# Altium schematic sheet ATSAM4E16EA_AU Main Controller.SchDoc
size C
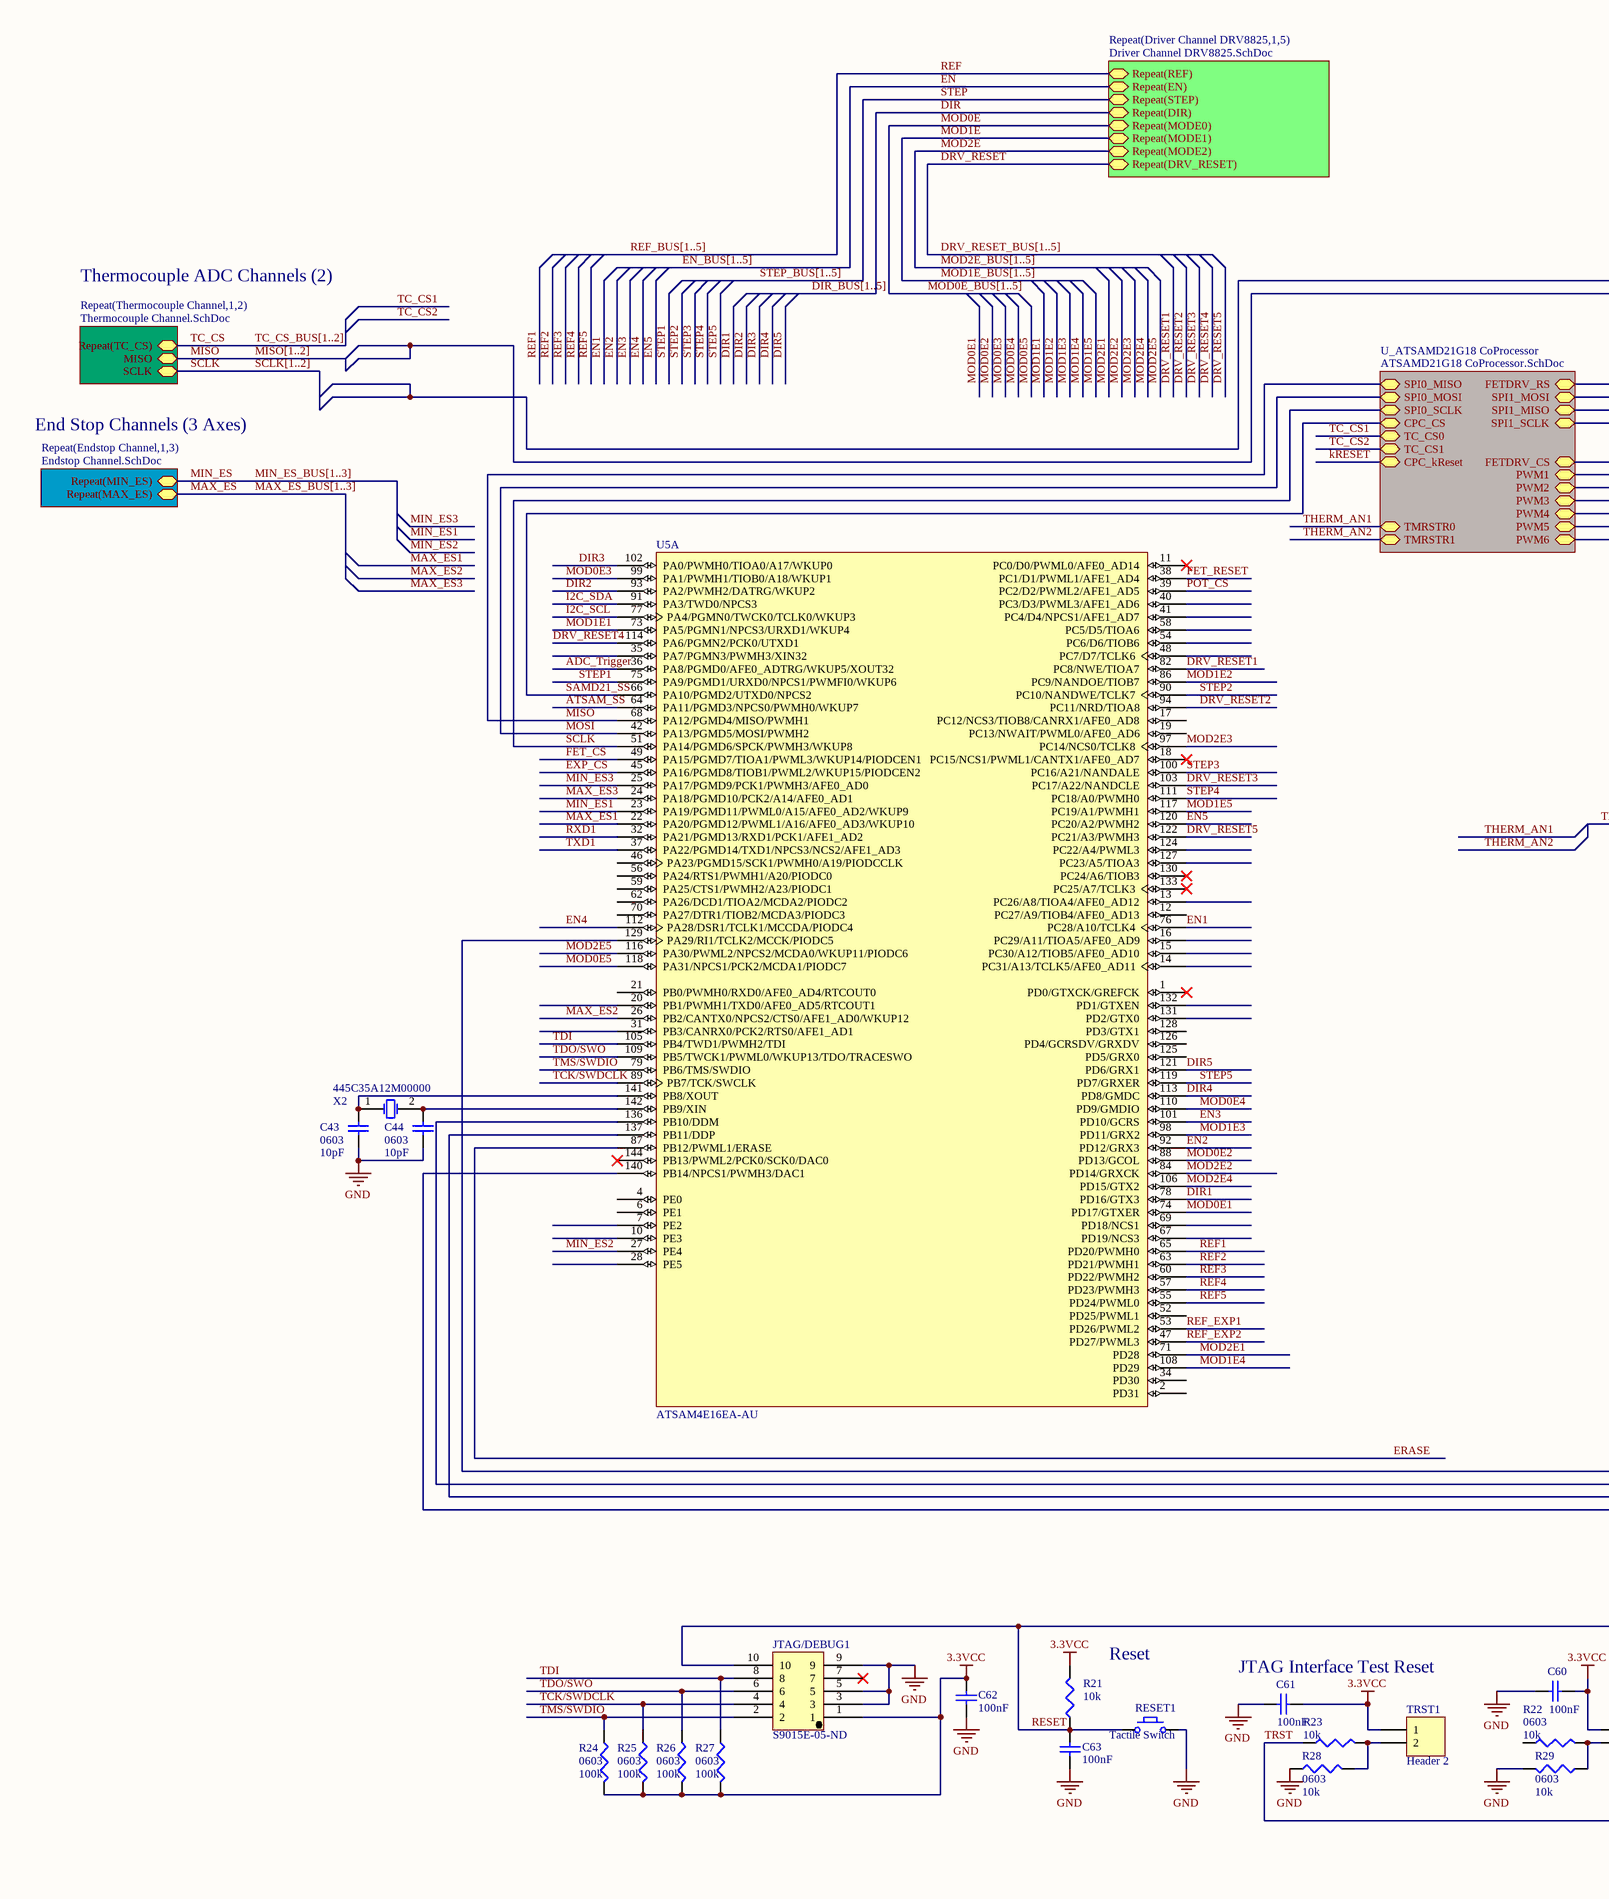
[diagram p0: ATSAM4E16EA_AU Main Controller.SchDoc, left]
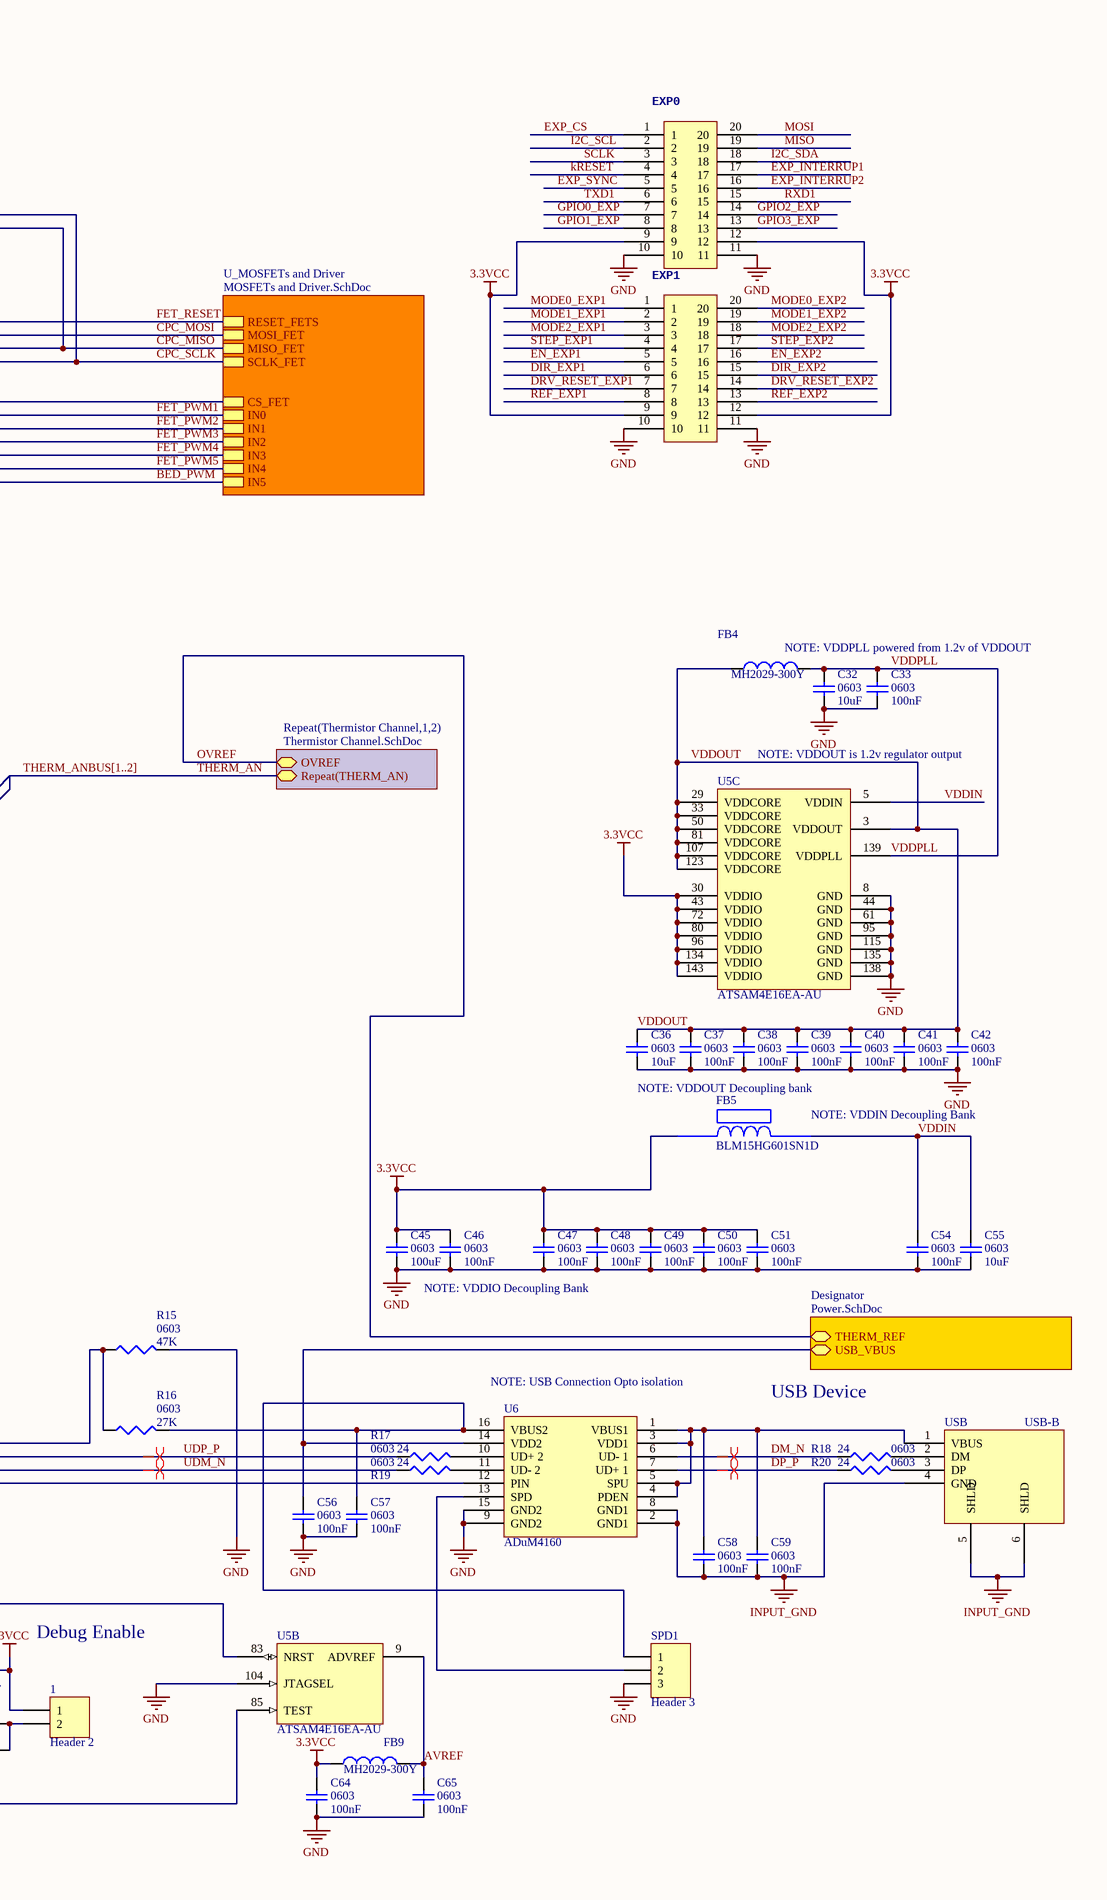
[diagram p1: ATSAM4E16EA_AU Main Controller.SchDoc, right]

## Parts
1  Header 2  [HDR1X2]
C32  0603  value 10uF  [1608[0603]]
C33  0603  value 100nF  [1608[0603]]
C36  0603  value 10uF  [1608[0603]]
C37  0603  value 100nF  [1608[0603]]
C38  0603  value 100nF  [1608[0603]]
C39  0603  value 100nF  [1608[0603]]
C40  0603  value 100nF  [1608[0603]]
C41  0603  value 100nF  [1608[0603]]
C42  0603  value 100nF  [1608[0603]]
C43  0603  value 10pF  [1608[0603]]
C44  0603  value 10pF  [1608[0603]]
C45  0603  value 100uF  [1608[0603]]
C46  0603  value 100nF  [1608[0603]]
C47  0603  value 100nF  [1608[0603]]
C48  0603  value 100nF  [1608[0603]]
C49  0603  value 100nF  [1608[0603]]
C50  0603  value 100nF  [1608[0603]]
C51  0603  value 100nF  [1608[0603]]
C54  0603  value 100nF  [1608[0603]]
C55  0603  value 10uF  [1608[0603]]
C56  0603  value 100nF  [1608[0603]]
C57  0603  value 100nF  [1608[0603]]
C58  0603  value 100nF  [1608[0603]]
C59  0603  value 100nF  [1608[0603]]
C60  value 100nF  [1608[0603]]  (hidden comment: Cap Semi)
C61  value 100nF  [1608[0603]]  (hidden comment: Cap Semi)
C62  value 100nF  [1608[0603]]  (hidden comment: Cap Semi)
C63  value 100nF  [1608[0603]]  (hidden comment: Cap Semi)
C64  0603  value 100nF  [1608[0603]]
C65  0603  value 100nF  [1608[0603]]
EXP0  10X2-0.1X0.05  [10X2-0.05X0.1]  (value not drawn)
EXP1  10X2-0.1X0.05  [10X2-0.05X0.1]  (value not drawn)
FB4  MH2029-300Y  [SM 0805 - gap trimmed]
FB5  BLM15HG601SN1D  [BLM18PG121SN1D]
FB9  MH2029-300Y  [SM 0805 - gap trimmed]
JTAG/DEBUG1  S9015E-05-ND  [S9015E-05-ND]
R15  0603  value 47K  [J1-0603]
R16  0603  value 27K  [J1-0603]
R17  0603  value 24  [J1-0603]
R18  0603  value 24  [J1-0603]
R19  0603  value 24  [J1-0603]
R20  0603  value 24  [J1-0603]
R21  value 10k  [J1-0603]  (hidden comment: Res3)
R22  0603  value 10k  [J1-0603]
R23  value 10k  [J1-0603]  (hidden comment: Res3)
R24  0603  value 100k  [J1-0603]
R25  0603  value 100k  [J1-0603]
R26  0603  value 100k  [J1-0603]
R27  0603  value 100k  [J1-0603]
R28  0603  value 10k  [J1-0603]
R29  0603  value 10k  [J1-0603]
RESET1  Tactile Switch  [TL3301]
SPD1  Header 3  [HDR1X3]
TRST1  Header 2  [HDR1X2]
U5  ATSAM4E16EA-AU  [LQFP144_N]  (parts A,B,C of 3)
U6  ADuM4160  [ADuM4160]
USB  USB-B  [PN61729]
X2  445C35A12M00000  [445C35A12M00000]

## Sub-sheets
Designator = Power.SchDoc: USB_VBUS (bidir), THERM_REF
Repeat(Driver Channel DRV8825,1,5) = Driver Channel DRV8825.SchDoc: Repeat(REF), Repeat(EN), Repeat(STEP), Repeat(DIR), Repeat(MODE0), Repeat(MODE1), Repeat(MODE2), Repeat(DRV_RESET)
Repeat(Endstop Channel,1,3) = Endstop Channel.SchDoc: Repeat(MAX_ES), Repeat(MIN_ES)
Repeat(Thermistor Channel,1,2) = Thermistor Channel.SchDoc: OVREF, Repeat(THERM_AN)
Repeat(Thermocouple Channel,1,2) = Thermocouple Channel.SchDoc: SCLK, MISO, Repeat(TC_CS)
U_ATSAMD21G18 CoProcessor = ATSAMD21G18 CoProcessor.SchDoc: SPI0_MOSI, SPI0_MISO, SPI0_SCLK, CPC_CS, SPI1_MOSI, SPI1_MISO, SPI1_SCLK, TC_CS0, TC_CS1, FETDRV_CS, FETDRV_RS, PWM1, PWM2, PWM3, PWM4, PWM5, PWM6, CPC_kReset, TMRSTR0, TMRSTR1
U_MOSFETs and Driver = MOSFETs and Driver.SchDoc: RESET_FETS, MISO_FET, SCLK_FET, MOSI_FET, CS_FET, IN0, IN1, IN2, IN3, IN4, IN5

## Nets
3.3VCC: 1.1 C45.2 C46.2 C47.2 C48.2 C49.2 C50.2 C51.2 C60.2 C61.2 C62.2 C64.2 EXP0.9 EXP0.12 EXP1.9 EXP1.12 FB5.1 FB9.1 JTAG/DEBUG1.1 R21.2 R24.2 R25.2 R26.2 R27.2 TRST1.1 U5.30(VDDIO) U5.43(VDDIO) U5.72(VDDIO) U5.80(VDDIO) U5.96(VDDIO) U5.134(VDDIO) U5.143(VDDIO)
GND: C32.1 C33.1 C36.1 C37.1 C38.1 C39.1 C40.1 C41.1 C42.1 C43.1 C44.1 C45.1 C46.1 C47.1 C48.1 C49.1 C50.1 C51.1 C54.1 C55.1 C56.1 C57.1 C60.1 C61.1 C62.1 C63.1 C64.1 C65.1 EXP0.10 EXP0.11 EXP1.10 EXP1.11 JTAG/DEBUG1.3 JTAG/DEBUG1.5 JTAG/DEBUG1.9 R15.2 R28.1 R29.2 RESET1.2 SPD1.3 U5.8(GND) U5.44(GND) U5.61(GND) U5.95(GND) U5.104(JTAGSEL) U5.115(GND) U5.135(GND) U5.138(GND) U6.9(GND2) U6.15(GND2)
INPUT_GND: C58.1 C59.1 U6.2(GND1) U6.8(GND1) USB.4(GND) USB.5(SHLD) USB.6(SHLD)
ADC_Trigger: U5.36(PA8/PGMD0/AFE0_ADTRG/WKUP5/XOUT32)
ATSAM_SS: U5.64(PA11/PGMD3/NPCS0/PWMH0/WKUP7)
AVREF: C65.2 FB9.2 U5.9(ADVREF)
BED_PWM: sheet U_MOSFETs and Driver/IN5, sheet U_ATSAMD21G18 CoProcessor/PWM6
CPC_MISO: sheet U_MOSFETs and Driver/MISO_FET, sheet U_ATSAMD21G18 CoProcessor/SPI1_MISO
CPC_MOSI: sheet U_MOSFETs and Driver/MOSI_FET, sheet U_ATSAMD21G18 CoProcessor/SPI1_MOSI
CPC_SCLK: sheet U_MOSFETs and Driver/SCLK_FET, sheet U_ATSAMD21G18 CoProcessor/SPI1_SCLK
DIR: sheet Repeat(Driver Channel DRV8825,1,5)/Repeat(DIR)
DIR1: U5.78(PD16/GTX3)
DIR2: U5.93(PA2/PWMH2/DATRG/WKUP2)
DIR3: U5.102(PA0/PWMH0/TIOA0/A17/WKUP0)
DIR4: U5.113(PD8/GMDC)
DIR5: U5.121(PD6/GRX1)
DIR_EXP1: EXP1.6
DIR_EXP2: EXP1.15
DM_N: R18.1 U6.6(UD-_1)
DP_P: R20.1 U6.7(UD+_1)
DRV_RESET: sheet Repeat(Driver Channel DRV8825,1,5)/Repeat(DRV_RESET)
DRV_RESET1: U5.82(PC8/NWE/TIOA7)
DRV_RESET2: U5.94(PC11/NRD/TIOA8)
DRV_RESET3: U5.103(PC17/A22/NANDCLE)
DRV_RESET4: U5.114(PA6/PGMN2/PCK0/UTXD1)
DRV_RESET5: U5.122(PC21/A3/PWMH3)
DRV_RESET_EXP1: EXP1.7
DRV_RESET_EXP2: EXP1.14
EN: sheet Repeat(Driver Channel DRV8825,1,5)/Repeat(EN)
EN1: U5.76(PC28/A10/TCLK4)
EN2: U5.92(PD12/GRX3)
EN3: U5.101(PD10/GCRS)
EN4: U5.112(PA28/DSR1/TCLK1/MCCDA/PIODC4)
EN5: U5.120(PC20/A2/PWMH2)
EN_EXP1: EXP1.5
EN_EXP2: EXP1.16
ERASE: U5.87(PB12/PWML1/ERASE)
EXP_CS: EXP0.1 U5.45(PA16/PGMD8/TIOB1/PWML2/WKUP15/PIODCEN2)
EXP_INTERRUP1: EXP0.17
EXP_INTERRUP2: EXP0.16
EXP_SYNC: EXP0.5
FET_CS: U5.49(PA15/PGMD7/TIOA1/PWML3/WKUP14/PIODCEN1)
FET_PWM1: sheet U_MOSFETs and Driver/IN0, sheet U_ATSAMD21G18 CoProcessor/PWM1
FET_PWM2: sheet U_MOSFETs and Driver/IN1, sheet U_ATSAMD21G18 CoProcessor/PWM2
FET_PWM3: sheet U_MOSFETs and Driver/IN2, sheet U_ATSAMD21G18 CoProcessor/PWM3
FET_PWM4: sheet U_MOSFETs and Driver/IN3, sheet U_ATSAMD21G18 CoProcessor/PWM4
FET_PWM5: sheet U_MOSFETs and Driver/IN4, sheet U_ATSAMD21G18 CoProcessor/PWM5
FET_RESET: U5.38(PC1/D1/PWML1/AFE1_AD4) ; sheet U_MOSFETs and Driver/RESET_FETS, sheet U_ATSAMD21G18 CoProcessor/FETDRV_RS
GPIO0_EXP: EXP0.7
GPIO1_EXP: EXP0.8
GPIO2_EXP: EXP0.14
GPIO3_EXP: EXP0.13
I2C_SCL: EXP0.2 U5.77(PA4/PGMN0/TWCK0/TCLK0/WKUP3)
I2C_SDA: EXP0.18 U5.91(PA3/TWD0/NPCS3)
kRESET: EXP0.4 ; sheet U_ATSAMD21G18 CoProcessor/CPC_kReset
MAX_ES: sheet Repeat(Endstop Channel,1,3)/Repeat(MAX_ES)
MAX_ES1: U5.22(PA20/PGMD12/PWML1/A16/AFE0_AD3/WKUP10)
MAX_ES2: U5.26(PB2/CANTX0/NPCS2/CTS0/AFE1_AD0/WKUP12)
MAX_ES3: U5.24(PA18/PGMD10/PCK2/A14/AFE0_AD1)
MIN_ES: sheet Repeat(Endstop Channel,1,3)/Repeat(MIN_ES)
MIN_ES1: U5.23(PA19/PGMD11/PWML0/A15/AFE0_AD2/WKUP9)
MIN_ES2: U5.27(PE4)
MIN_ES3: U5.25(PA17/PGMD9/PCK1/PWMH3/AFE0_AD0)
MISO: EXP0.19 U5.68(PA12/PGMD4/MISO/PWMH1) ; sheet Repeat(Thermocouple Channel,1,2)/MISO, sheet U_ATSAMD21G18 CoProcessor/SPI0_MISO
MOD0E: sheet Repeat(Driver Channel DRV8825,1,5)/Repeat(MODE0)
MOD0E1: U5.74(PD17/GTXER)
MOD0E2: U5.88(PD13/GCOL)
MOD0E3: U5.99(PA1/PWMH1/TIOB0/A18/WKUP1)
MOD0E4: U5.110(PD9/GMDIO)
MOD0E5: U5.118(PA31/NPCS1/PCK2/MCDA1/PIODC7)
MOD1E: sheet Repeat(Driver Channel DRV8825,1,5)/Repeat(MODE1)
MOD1E1: U5.73(PA5/PGMN1/NPCS3/URXD1/WKUP4)
MOD1E2: U5.86(PC9/NANDOE/TIOB7)
MOD1E3: U5.98(PD11/GRX2)
MOD1E4: U5.108(PD29)
MOD1E5: U5.117(PC19/A1/PWMH1)
MOD2E: sheet Repeat(Driver Channel DRV8825,1,5)/Repeat(MODE2)
MOD2E1: U5.71(PD28)
MOD2E2: U5.84(PD14/GRXCK)
MOD2E3: U5.97(PC14/NCS0/TCLK8)
MOD2E4: U5.106(PD15/GTX2)
MOD2E5: U5.116(PA30/PWML2/NPCS2/MCDA0/WKUP11/PIODC6)
MODE0_EXP1: EXP1.1
MODE0_EXP2: EXP1.20
MODE1_EXP1: EXP1.2
MODE1_EXP2: EXP1.19
MODE2_EXP1: EXP1.3
MODE2_EXP2: EXP1.18
MOSI: EXP0.20 U5.42(PA13/PGMD5/MOSI/PWMH2) ; sheet U_ATSAMD21G18 CoProcessor/SPI0_MOSI
OVREF: sheet Repeat(Thermistor Channel,1,2)/OVREF, sheet Designator/THERM_REF
POT_CS: U5.39(PC2/D2/PWML2/AFE1_AD5)
REF: sheet Repeat(Driver Channel DRV8825,1,5)/Repeat(REF)
REF1: U5.65(PD20/PWMH0)
REF2: U5.63(PD21/PWMH1)
REF3: U5.60(PD22/PWMH2)
REF4: U5.57(PD23/PWMH3)
REF5: U5.55(PD24/PWML0)
REF_EXP1: EXP1.8 U5.53(PD26/PWML2)
REF_EXP2: EXP1.13 U5.47(PD27/PWML3)
RESET: C63.2 JTAG/DEBUG1.10 R21.1 RESET1.1 U5.83(NRST)
RXD1: EXP0.15 U5.32(PA21/PGMD13/RXD1/PCK1/AFE1_AD2)
SAMD21_SS: U5.66(PA10/PGMD2/UTXD0/NPCS2) ; sheet U_ATSAMD21G18 CoProcessor/CPC_CS
SCLK: EXP0.3 U5.51(PA14/PGMD6/SPCK/PWMH3/WKUP8) ; sheet Repeat(Thermocouple Channel,1,2)/SCLK, sheet U_ATSAMD21G18 CoProcessor/SPI0_SCLK
STEP: sheet Repeat(Driver Channel DRV8825,1,5)/Repeat(STEP)
STEP1: U5.75(PA9/PGMD1/URXD0/NPCS1/PWMFI0/WKUP6)
STEP2: U5.90(PC10/NANDWE/TCLK7)
STEP3: U5.100(PC16/A21/NANDALE)
STEP4: U5.111(PC18/A0/PWMH0)
STEP5: U5.119(PD7/GRXER)
STEP_EXP1: EXP1.4
STEP_EXP2: EXP1.17
TC_CS: sheet Repeat(Thermocouple Channel,1,2)/Repeat(TC_CS)
TC_CS1: sheet U_ATSAMD21G18 CoProcessor/TC_CS0
TC_CS2: sheet U_ATSAMD21G18 CoProcessor/TC_CS1
TCK/SWDCLK: JTAG/DEBUG1.4 R25.1 U5.89(PB7/TCK/SWCLK)
TDI: JTAG/DEBUG1.8 R27.1 U5.105(PB4/TWD1/PWMH2/TDI)
TDO/SWO: JTAG/DEBUG1.6 R26.1 U5.109(PB5/TWCK1/PWML0/WKUP13/TDO/TRACESWO)
THERM_AN: sheet Repeat(Thermistor Channel,1,2)/Repeat(THERM_AN)
THERM_AN1: sheet U_ATSAMD21G18 CoProcessor/TMRSTR0
THERM_AN2: sheet U_ATSAMD21G18 CoProcessor/TMRSTR1
TMS/SWDIO: JTAG/DEBUG1.2 R24.1 U5.79(PB6/TMS/SWDIO)
TRST: R23.1 U5.85(TEST)
TXD1: EXP0.6 U5.37(PA22/PGMD14/TXD1/NPCS3/NCS2/AFE1_AD3)
UDM_N: R19.1 U5.137(PB11/DDP)
UDP_P: R17.1 U5.136(PB10/DDM)
VDDIN: C54.2 C55.2 FB5.2 U5.5(VDDIN)
VDDOUT: C36.2 C37.2 C38.2 C39.2 C40.2 C41.2 C42.2 FB4.1 U5.3(VDDOUT) U5.29(VDDCORE) U5.33(VDDCORE) U5.50(VDDCORE) U5.81(VDDCORE) U5.107(VDDCORE) U5.123(VDDCORE)
VDDPLL: C32.2 C33.2 FB4.2 U5.139(VDDPLL)
Net1_2: 1.2 R22.2 R29.1
NetC43_2: C43.2 U5.141(PB8/XOUT) X2.1(OSC1)
NetC44_2: C44.2 U5.142(PB9/XIN) X2.2(OSC2)
NetC56_2: C56.2 U6.14(VDD2) ; sheet Designator/USB_VBUS
NetC57_2: C57.2 R16.2 SPD1.1 U6.16(VBUS2)
NetC58_2: C58.2 C59.2 U6.1(VBUS1) U6.3(VDD1) U6.4(PDEN) U6.5(SPU) USB.1(VBUS)
NetR15_1: R15.1 R16.1 U5.129(PA29/RI1/TCLK2/MCCK/PIODC5)
NetR17_2: R17.2 U6.10(UD+_2)
NetR18_2: R18.2 USB.2(DM)
NetR19_2: R19.2 U6.11(UD-_2)
NetR20_2: R20.2 USB.3(DP)
NetR23_2: R23.2 R28.2 TRST1.2
NetSPD1_2: SPD1.2 U6.13(SPD)
NetU5_140: U5.140(PB14/NPCS1/PWMH3/DAC1) U6.12(PIN)
(unnamed): sheet U_MOSFETs and Driver/CS_FET, sheet U_ATSAMD21G18 CoProcessor/FETDRV_CS

Not connected (* = marked no-connect by the designer): JTAG/DEBUG1 7*; R22 1; U5 1(PD0/GTXCK/GREFCK)* 2(PD31) 4(PE0) 6(PE1) 7(PE2) 10(PE3) 11(PC0/D0/PWML0/AFE0_AD14)* 12(PC27/A9/TIOB4/AFE0_AD13) 13(PC26/A8/TIOA4/AFE0_AD12) 14(PC31/A13/TCLK5/AFE0_AD11) 15(PC30/A12/TIOB5/AFE0_AD10) 16(PC29/A11/TIOA5/AFE0_AD9) 17(PC12/NCS3/TIOB8/CANRX1/AFE0_AD8) 18(PC15/NCS1/PWML1/CANTX1/AFE0_AD7)* 19(PC13/NWAIT/PWML0/AFE0_AD6) 20(PB1/PWMH1/TXD0/AFE0_AD5/RTCOUT1) 21(PB0/PWMH0/RXD0/AFE0_AD4/RTCOUT0) 28(PE5) 31(PB3/CANRX0/PCK2/RTS0/AFE1_AD1) 34(PD30) 35(PA7/PGMN3/PWMH3/XIN32) 40(PC3/D3/PWML3/AFE1_AD6) 41(PC4/D4/NPCS1/AFE1_AD7) 46(PA23/PGMD15/SCK1/PWMH0/A19/PIODCCLK) 48(PC7/D7/TCLK6) 52(PD25/PWML1) 54(PC6/D6/TIOB6) 56(PA24/RTS1/PWMH1/A20/PIODC0) 58(PC5/D5/TIOA6) 59(PA25/CTS1/PWMH2/A23/PIODC1) 62(PA26/DCD1/TIOA2/MCDA2/PIODC2) 67(PD19/NCS3) 69(PD18/NCS1) 70(PA27/DTR1/TIOB2/MCDA3/PIODC3) 124(PC22/A4/PWML3) 125(PD5/GRX0) 126(PD4/GCRSDV/GRXDV) 127(PC23/A5/TIOA3) 128(PD3/GTX1) 130(PC24/A6/TIOB3)* 131(PD2/GTX0) 132(PD1/GTXEN) 133(PC25/A7/TCLK3)* 144(PB13/PWML2/PCK0/SCK0/DAC0)*

## Buses and harness runs
bus DIR_BUS[1..5]
bus DRV_RESET_BUS[1..5]
bus EN_BUS[1..5]
bus MAX_ES_BUS[1..3]
bus MIN_ES_BUS[1..3]
bus MISO[1..2]
bus MOD0E_BUS[1..5]
bus MOD1E_BUS[1..5]
bus MOD2E_BUS[1..5]
bus REF_BUS[1..5]
bus SCLK[1..2]
bus STEP_BUS[1..5]
bus TC_CS_BUS[1..2]
bus THERM_ANBUS[1..2]

## Layout directives
differential pair: DM_N, DP_P, UDM_N, UDP_P

## Notes on the sheet
- Thermocouple ADC Channels (2)
- End Stop Channels (3 Axes)
- (near FB4) NOTE: VDDPLL powered from 1.2v of VDDOUT
- NOTE: VDDOUT is 1.2v regulator output
- NOTE: VDDOUT Decoupling bank
- NOTE: VDDIN Decoupling Bank
- NOTE: VDDIO Decoupling Bank
- (near U6) NOTE: USB Connection Opto isolation
- USB Device
- Reset
- (near C61) JTAG Interface Test Reset
- Debug Enable

## Library data of the parts
1 TRST1 = Header 2: Header, 2-Pin; LatestRevisionDate: 17-Jul-2002; LatestRevisionNote: Re-released for DXP Platform.; Publisher: Altium Limited
C32 C33 C36-C51 C54-C65 = Cap Semi: Capacitor (Semiconductor SIM Model); Published: 8-Jun-2000; LatestRevisionDate: 29-May-2009; LatestRevisionNote: IPC-7351 Footprint Added.; PackageReference: C1206; Publisher: Altium Limited; PackageDescription: Chip Capacitor
EXP0 EXP1 = 10X2-0.1X0.05: LastRevisionNote: ImportComponents; Published: 23-Apr-2014; Publisher: UltiMachine; LastRevisionDate: 23-Apr-2014
FB4 FB9 = Inductor: Code_IEC: 1005; Published: 8-Jun-2000; LatestRevisionDate: 17-Jul-2002; LatestRevisionNote: Re-released for DXP Platform.; PackageReference: 0402-A; Publisher: Altium Limited; Code_JEITA: 0402
R15-R29 = Res3: Resistor; Published: 8-Jun-2000; LatestRevisionDate: 29-May-2009; LatestRevisionNote: IPC-7351 Footprint Added.; PackageReference: J1-0603; Publisher: Altium Limited; PackageDescription: Chip Resistor
SPD1 = Header 3: Header, 3-Pin; LatestRevisionDate: 17-Jul-2002; LatestRevisionNote: Re-released for DXP Platform.; Publisher: Altium Limited
U5 = ATML-ATSAM4EXEA-LQFP-144
U6 = ADuM4160: USB Opto Isolator
X2 = XTAL: Crystal Oscillator; Published: 8-Jun-2000; LatestRevisionDate: 17-Jul-2002; LatestRevisionNote: Re-released for DXP Platform.; PackageReference: R38; Publisher: Altium Limited; PackageDescription: Crystal, Thru-Hole; 2 Leads; Body 3.1 x 8.2 mm (Dia.xH)